# EAGLE design single_motor_driver_v6_patino (EAGLE 8.2.2)
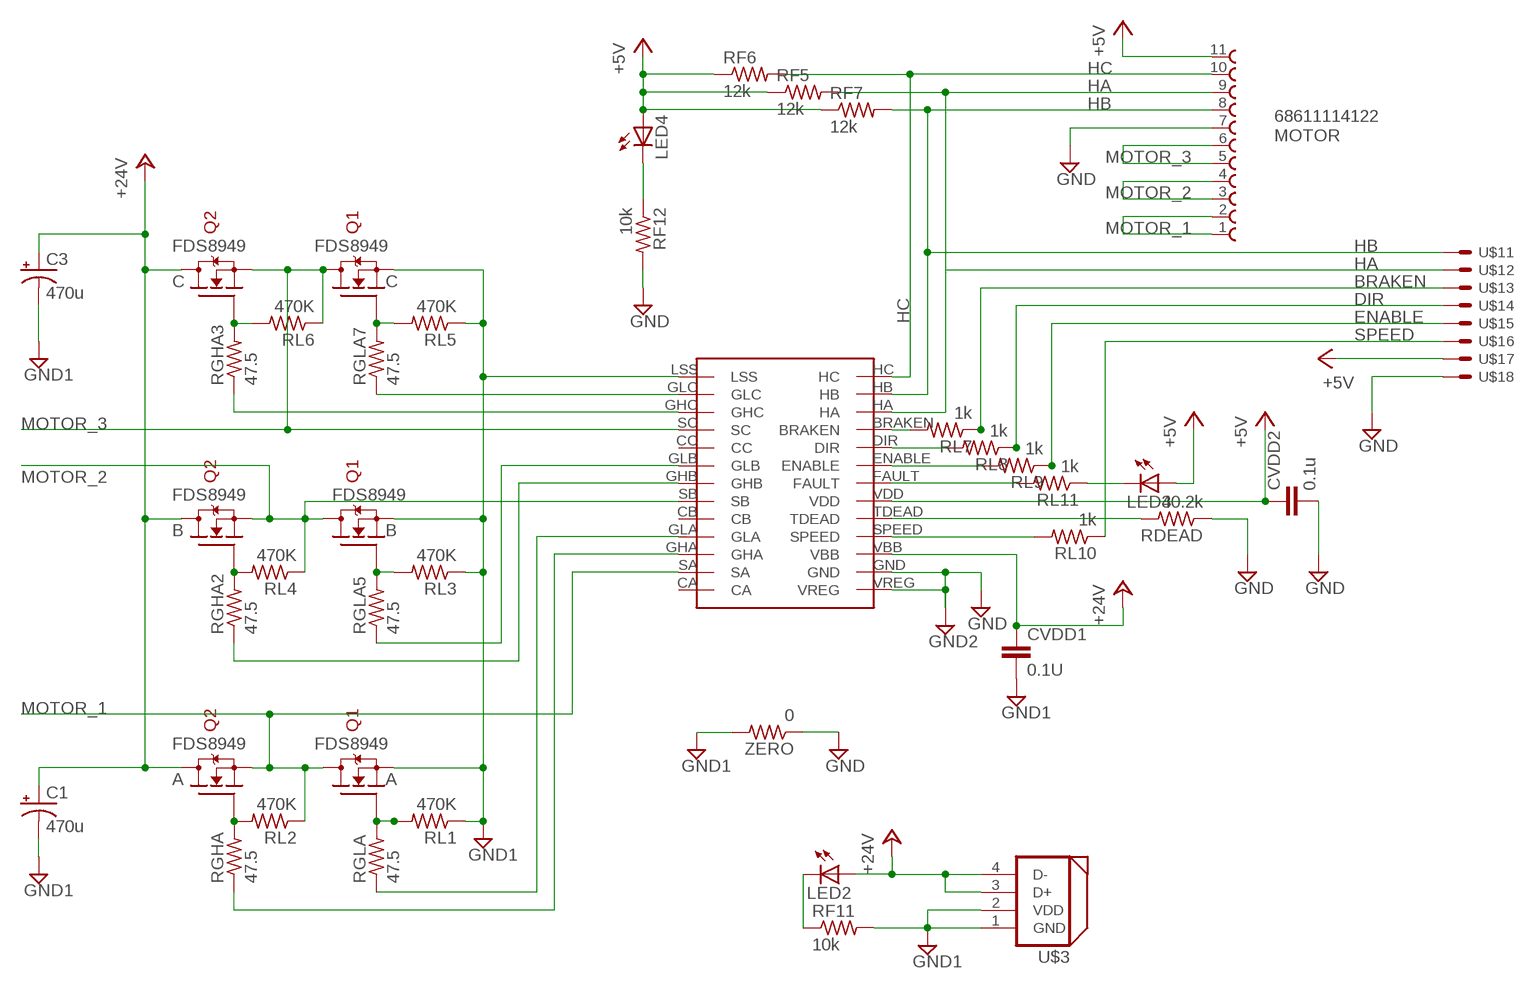
[diagram p0: schematic, sheet 1]

## Parts
A  FDS8949  [SOIC8]
B  FDS8949  [SOIC8]
C  FDS8949  [SOIC8]
C1  470u  CPOL-US140CLH-1010  [140CLH-1010]
C3  470u  CPOL-US140CLH-1010  [140CLH-1010]
CVDD1  0.1U  C-EUC0805  [C0805]
CVDD2  0.1u  C-EUC0805  [C0805]
LED2  LEDCHIPLED_0805  [CHIPLED_0805]
LED3  LEDCHIPLED_0805  [CHIPLED_0805]
LED4  LEDCHIPLED_0805  [CHIPLED_0805]
MOTOR  68611114122  [68611114122]
RDEAD  40.2k  R-US_R0805  [R0805]
RF5  12k  R-US_R0805  [R0805]
RF6  12k  R-US_R0805  [R0805]
RF7  12k  R-US_R0805  [R0805]
RF11  10k  R-US_R0805  [R0805]
RF12  10k  R-US_R0805  [R0805]
RGHA  47.5  R-US_R0805  [R0805]
RGHA2  47.5  R-US_R0805  [R0805]
RGHA3  47.5  R-US_R0805  [R0805]
RGLA  47.5  R-US_R0805  [R0805]
RGLA5  47.5  R-US_R0805  [R0805]
RGLA7  47.5  R-US_R0805  [R0805]
RL1  470K  R-US_R0805  [R0805]
RL2  470K  R-US_R0805  [R0805]
RL3  470K  R-US_R0805  [R0805]
RL4  470K  R-US_R0805  [R0805]
RL5  470K  R-US_R0805  [R0805]
RL6  470K  R-US_R0805  [R0805]
RL7  1k  R-US_R0805  [R0805]
RL8  1k  R-US_R0805  [R0805]
RL9  1k  R-US_R0805  [R0805]
RL10  1k  R-US_R0805  [R0805]
RL11  1k  R-US_R0805  [R0805]
U$1  JST8  [JST]
U$2  TSSOP28-BRK  [TSSOP28-BRK]
U$3  DYNAMIXEL_RS485  [DYNAMIXEL_SPOX_04]
ZERO  0  R-US_R0805  [R0805]

## Nets
+5V: CVDD2.1 LED3.A LED4.A MOTOR.11 RF5.1 RF6.1 RF7.1 U$1.7 U$2.VDD
+24V: A.5(D2) A.6(D2) B.5(D2) B.6(D2) C1.+ C3.+ C.5(D2) C.6(D2) CVDD1.1 LED2.A U$2.VBB U$3.3(D+) U$3.4(D-)
BRAKEN: RL7.1 U$1.3
DIR: RL8.1 U$1.4
ENABLE: RL9.1 U$1.5
GND: CVDD2.2 MOTOR.7 RDEAD.1 RF12.2 U$1.8 U$2.GND U$2.VREG ZERO.1 ; supply symbol labelled GND2
HA: MOTOR.9 RF5.2 U$1.2 U$2.HA
HB: MOTOR.8 RF7.2 U$1.1 U$2.HB
HC: MOTOR.10 RF6.2 U$2.HC
MOTOR_1: A.3(S2) A.7(D1) A.8(D1) MOTOR.1 MOTOR.2 RL2.1 U$2.SA
MOTOR_2: B.3(S2) B.7(D1) B.8(D1) MOTOR.3 MOTOR.4 RL4.1 U$2.SB
MOTOR_3: C.3(S2) C.7(D1) C.8(D1) MOTOR.5 MOTOR.6 RL6.1 U$2.SC
N$7: B.2(G1) RGLA5.2 RL3.2
N$8: B.4(G2) RGHA2.2 RL4.2
N$15: C.2(G1) RGLA7.2 RL5.2
N$17: RGHA.1 U$2.GHA
N$18: C.4(G2) RGHA3.2 RL6.2
N$20: RGLA.1 U$2.GLA
N$24: RGLA7.1 U$2.GLC
N$25: RGLA5.1 U$2.GLB
N$26: RGHA2.1 U$2.GHB
N$27: RGHA3.1 U$2.GHC
N$32: A.2(G1) RGLA.2 RL1.2
N$33: A.4(G2) RGHA.2 RL2.2
N$40: RL10.2 U$2.SPEED
N$41: RL9.2 U$2.ENABLE
N$42: RL8.2 U$2.DIR
N$44: RL7.2 U$2.BRAKEN
N$45: RDEAD.2 U$2.TDEAD
N$46: RL11.2 U$2.FAULT
N$47: LED3.C RL11.1
N$48: LED2.C RF11.1
N$59: LED4.C RF12.1
PGND: A.1(S1) B.1(S1) C1.- C3.- C.1(S1) CVDD1.2 RF11.2 RL1.1 RL3.1 RL5.1 U$2.LSS U$3.1(GND) U$3.2(VDD) ZERO.2 ; supply symbol labelled GND1
SPEED: RL10.1 U$1.6
Unconnected: U$2.CA U$2.CB U$2.CC

## Library data of the parts
A B C = dedo:FDS8949: Dual N-Channel PowerTrench® MOSFET https://www.fairchildsemi.com/datasheets/FD/FDS8949.pdf
C1 C3 = resistor:CPOL-US: POLARIZED CAPACITOR, American symbol
CVDD1 CVDD2 = resistor:C-EU: CAPACITOR, European symbol
LED2-LED4 = adafruit:LED: LED OSRAM: - CHIPLED LG R971, LG N971, LY N971, LG Q971, LY Q971, LO R971, LY R971 LH N974, LH R974 LS Q976, LO Q976, LY Q976 LO Q996 - Hyper CHIPLED LW Q18S LB Q993, LB Q99A, LB R99A - SideLED LS A670, LO A670, LY A670, LG A670, LP A670 LB A673, LV A673, LT A673, LW A673 LH A674 LY A675 LS A676, LA A676, LO A676, LY A676, LW A676 LS A679, LY A679, LG A679 - Hyper Micro SIDELED® LS Y876, LA Y876, LO Y876, LY Y876 LT Y87S - SmartLED LW L88C, LW L88S LB L89C, LB L89S, LG L890 LS L89K, LO L89K, LY L89K LS L896, LA L896, LO L896, LY L896 - TOPLED LS T670, LO T670, LY T670, LG T670, LP T670 LSG T670, LSP T670, LSY T670, LOP T670, LYG T670 LG T671, LOG T671, LSG T671 LB T673, LV T673, LT T673, LW T673 LH T674 LS T676, LA T676, LO T676, LY T676, LB T676, LH T676, LSB T676, LW T676 LB T67C, LV T67C, LT T67C, LS T67K, LO T67K, LY T67K, LW E67C LS E67B, LA E67B, LO E67B, LY E67B, LB E67C, LV E67C, LT E67C LW T67C LS T679, LY T679, LG T679 LS T770, LO T770, LY T770, LG T770, LP T770 LB T773, LV T773, LT T773, LW T773 LH T774 LS E675, LA E675, LY E675, LS T675 LS T776, LA T776, LO T776, LY T776, LB T776 LHGB T686 LT T68C, LB T68C - Hyper Mini TOPLED® LB M676 - Mini TOPLED Santana® LG M470 LS M47K, LO M47K, LY M47K Source: http://www.osram.convergy.de/
MOTOR = FPC_Connectors_Flat_Flexible_Cable_rev15c:68611114122: WR-FPC 1.00mm SMT ZIF Horizontal Top Contact, 11 Pins=>Code : Con_FPC_ZIF_1.00_68611114122 <http://katalog.we-online.de/media/images/eican/Con_FPC_ZIF_1.00_6861xx14122_pf2.jpg> Details see: http://katalog.we-online.de/en/em/686_1xx_141_22 Created 2014-07-09, Karrer Zheng 2014 (C) Würth Elektronik
RDEAD RF5-RF7 RF11 RF12 RGHA RGHA2 RGHA3 RGLA RGLA5 RGLA7 RL1-RL11 ZERO = resistor:R-US_: RESISTOR, American symbol
U$1 = dedo:JST8
U$2 = dedo:TSSOP28-BRK
U$3 = uchile_robotics_eagle_lib:DYNAMIXEL_RS485: Dynamixel RS-485 Connector Molex LLC SPOX 4 Male connector Digikey code: WM18888-ND

## Net classes
0 default: clearance 0.205 mm

## Board
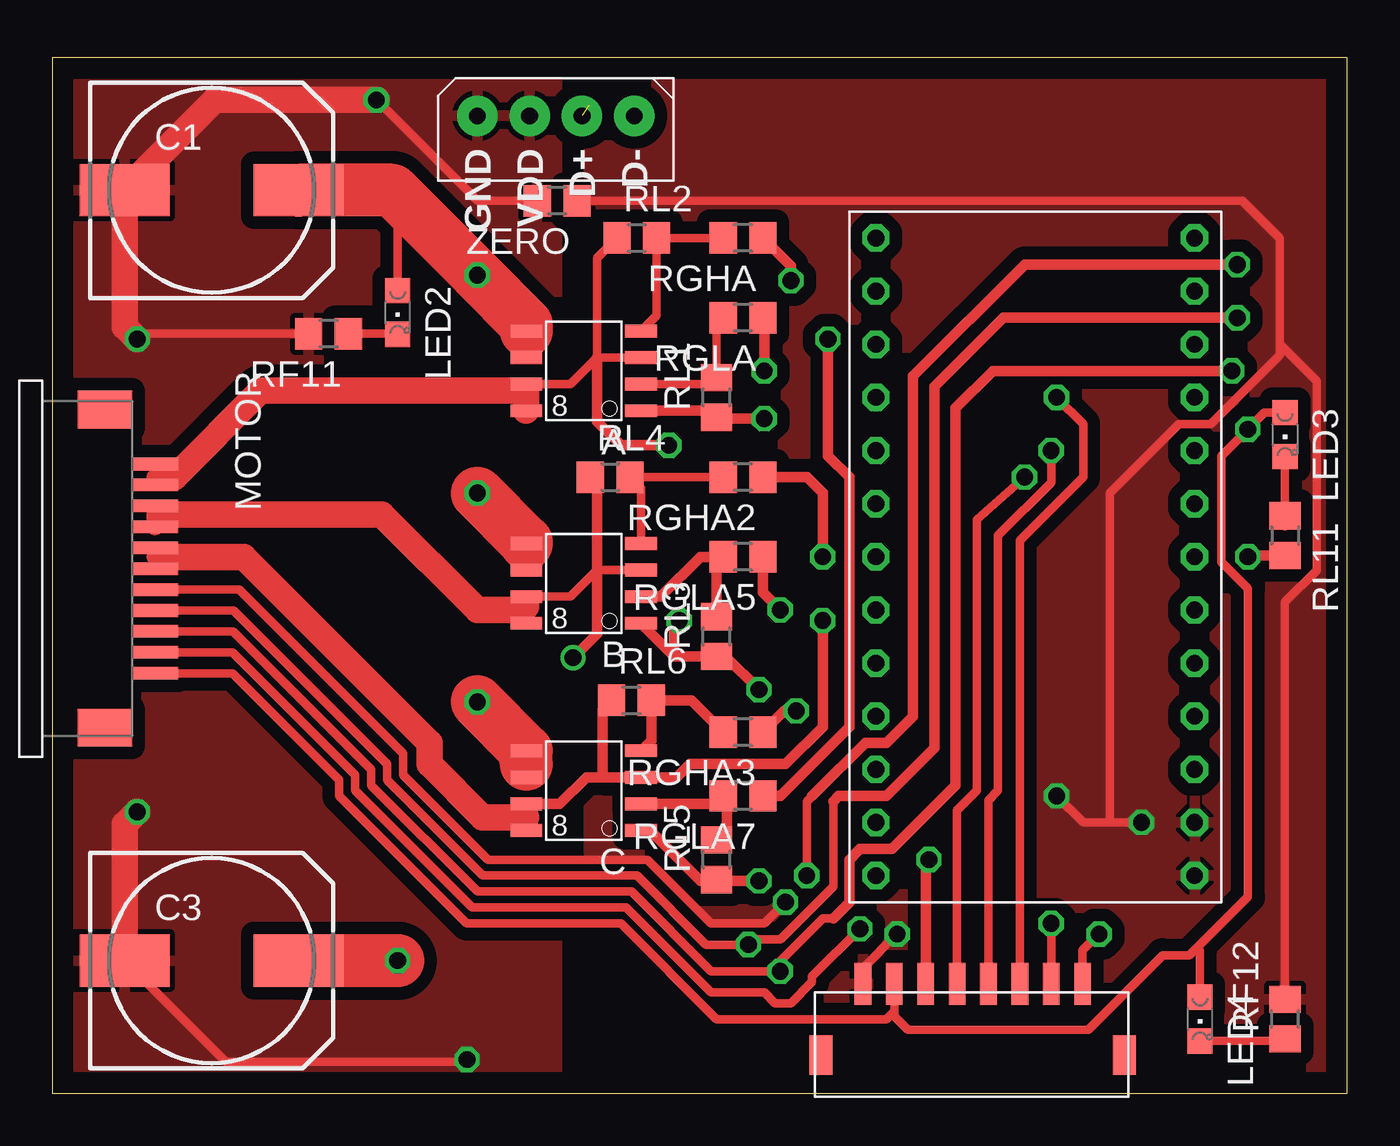
[diagram p1: board, top side]
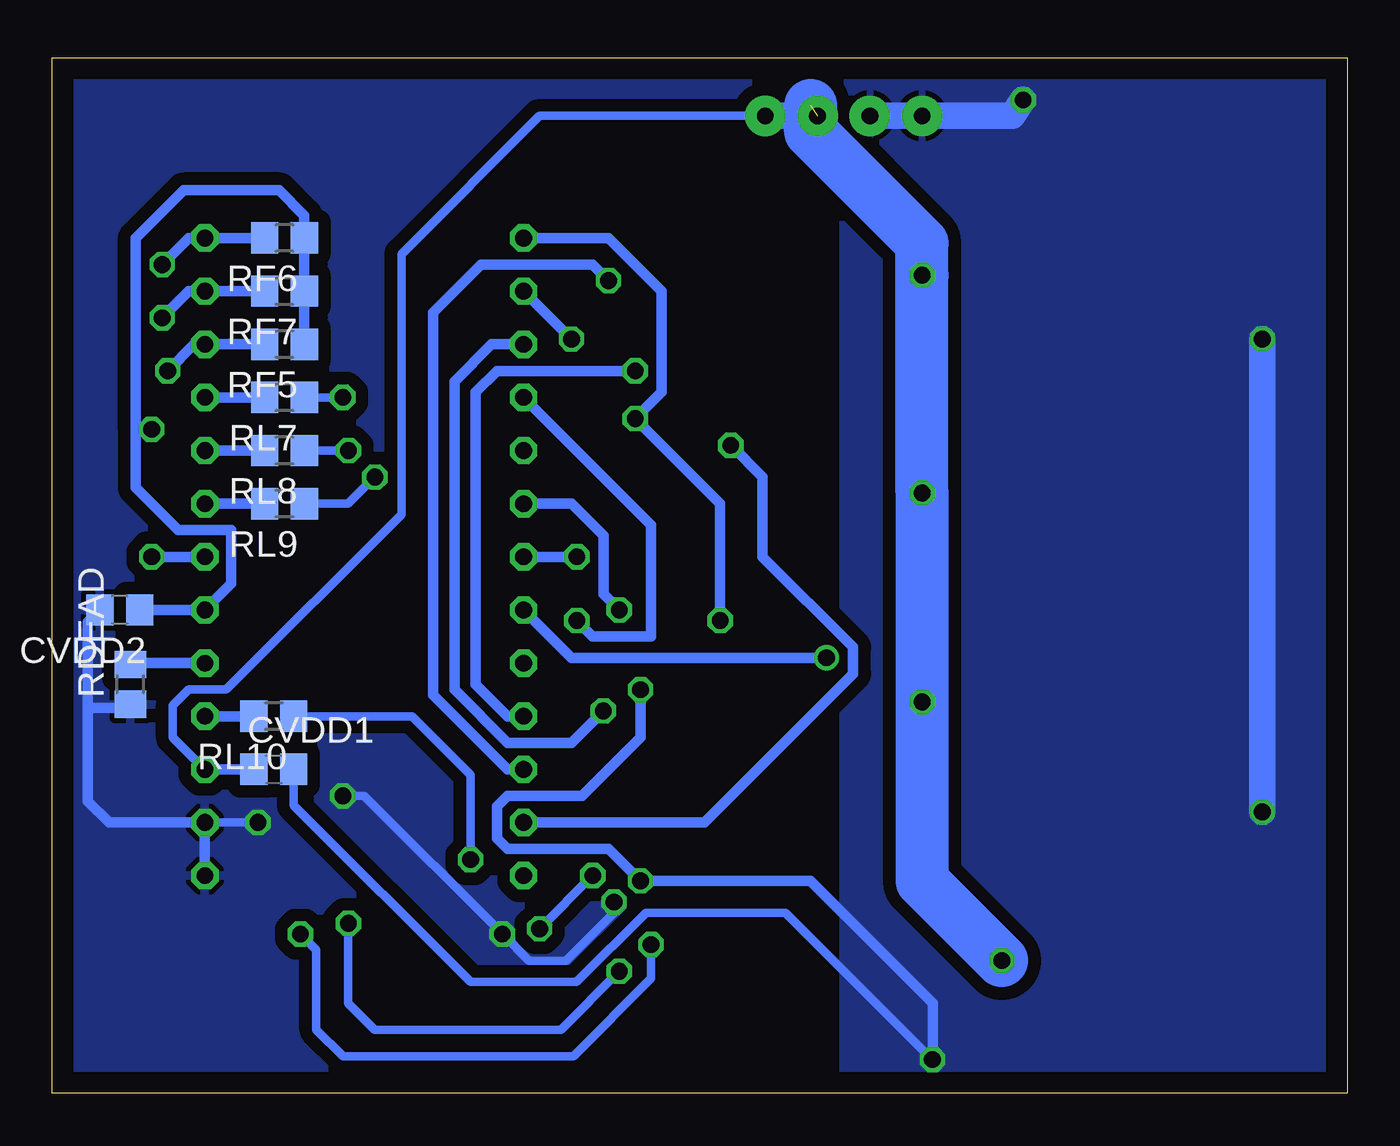
[diagram p2: board, bottom side, seen from below]

Size 61.9 x 49.52 mm. Coordinates in mm from the lower left corner, seen from the top.
Outline: 0,0 61.9,0 61.9,49.52 0,49.52 0,0
Copper layers (1*16): Top 0.035mm / dielectric 1.5mm / Bottom 0.035mm
Design rules "default": minimum track width 6mil, minimum drill 0.35mm, track to track 6mil, track to pad 6mil, pad to pad 6mil, via to via 6mil, smd to smd 6mil, copper to edge 40mil, drill to drill 6mil, minimum pad ring 10mil, minimum via ring 8mil, stop-mask expansion 4mil, vias tented up to drill 0mil, thermal gap 10mil

### Footprints (pad centres in the part's own frame; a part is rotated, then mirrored left to right if it is on the bottom)
SOIC8 = smd 1.524 x 0.61: 1 -2.743,1.905; 2 -2.743,0.635; 3 -2.743,-0.635; 4 -2.743,-1.905; 5 2.743,-1.905; 6 2.743,-0.635; 7 2.743,0.635; 8 2.743,1.905
140CLH-1010 = smd 4.3 x 2.5: + 4.15,0; - -4.15,0
C0805 = smd 1.3 x 1.5: 1 -0.95,0; 2 0.95,0
CHIPLED_0805 = smd 1.2 x 1.2: A 0,-1.05; C 0,1.05
68611114122 = smd 0.6 x 2.2: 1 -8.5,1.1; 2 -7.5,1.1; 3 -6.5,1.1; 4 -5.5,1.1; 5 -4.5,1.1; 6 -3.5,1.1; 7 -2.5,1.1; 8 -1.5,1.1; 9 -0.5,1.1; 10 0.5,1.1; 11 1.5,1.1 | smd 1.8 x 2.6: Z1 -11.1,-1.3; Z2 4.1,-1.3
R0805 = smd 1.3 x 1.5: 1 -0.95,0; 2 0.95,0
JST = smd 0.8 x 2: 1 -4.8,-2.7; 2 -3.3,-2.7; 3 -1.8,-2.7; 4 -0.3,-2.7; 5 1.2,-2.7; 6 2.7,-2.7; 7 4.2,-2.7; 8 5.7,-2.7 | smd 1.1 x 1.9: 9 -6.8,0.7; 10 7.7,0.7
TSSOP28-BRK = drill 0.8 octagon: BRAKEN 7.62,8.89; CA -7.62,-13.97; CB -7.62,-3.81; CC -7.62,6.35; DIR 7.62,6.35; ENABLE 7.62,3.81; FAULT 7.62,1.27; GHA -7.62,-8.89; GHB -7.62,1.27; GHC -7.62,11.43; GLA -7.62,-6.35; GLB -7.62,3.81; GLC -7.62,13.97; GND 7.62,-11.43; HA 7.62,11.43; HB 7.62,13.97; HC 7.62,16.51; LSS -7.62,16.51; SA -7.62,-11.43; SB -7.62,-1.27; SC -7.62,8.89; SPEED 7.62,-6.35; TDEAD 7.62,-3.81; VBB 7.62,-8.89; VDD 7.62,-1.27; VREG 7.62,-13.97
DYNAMIXEL_SPOX_04 = drill 0.8 pad 1.93: 1 0,0; 2 2.5,0; 3 5,0; 4 7.5,0

### Placement (x,y rotation side)
A  25.4,34.54 180 top
B  25.4,24.38 180 top
C  25.4,14.48 180 top
C1  7.62,43.18 0 top
C3  7.62,6.35 0 top
CVDD1  51.31,15.49 0 bottom
CVDD2  58.67,23.11 180 bottom
LED2  16.51,37.34 180 top
LED3  58.93,31.5 180 top
LED4  54.86,3.56 180 top
MOTOR  3.81,21.59 270 top
RDEAD  58.17,19.56 90 bottom
RF5  50.8,35.81 180 bottom
RF6  50.8,40.89 180 bottom
RF7  50.8,38.35 180 bottom
RF11  13.21,36.32 180 top
RF12  58.93,3.56 90 top
RGHA  33.02,40.89 180 top
RGHA2  33.02,29.46 180 top
RGHA3  33.02,17.27 180 top
RGLA  33.02,37.08 180 top
RGLA5  33.02,25.65 180 top
RGLA7  33.02,14.22 180 top
RL1  31.75,33.27 90 top
RL2  27.94,40.89 0 top
RL3  31.75,21.84 90 top
RL4  26.67,29.46 0 top
RL5  31.75,11.18 90 top
RL6  27.69,18.8 0 top
RL7  50.8,33.27 180 bottom
RL8  50.8,30.73 180 bottom
RL9  50.8,28.19 180 bottom
RL10  51.31,18.03 180 bottom
RL11  58.93,26.67 270 top
U$1  44.45,2.54 180 top
U$2  46.99,24.38 0 top
U$3  20.32,46.74 0 top
ZERO  24.13,42.67 180 top

### Tracks (layer width: path | path; a pad name or v marks a point on that pad's centre or on a via)
+5V  (via drill 0.8)
  Top 0.406: MOTOR.11 8.61,20.09 13.72,14.99 13.72,14.22 19.81,8.13 27.18,8.13 31.75,3.56 39.88,3.56 40.25,3.93 U$1.7 40.25,3.69 40.89,3.05 49.53,3.05 53.09,6.6 54.36,6.6 54.73,6.98 | 54.73,6.98 57.15,9.4 57.15,24.13 55.88,25.4 55.88,30.48 v57.15,31.75 57.95,32.55 LED3.A | LED4.A 54.86,6.85 54.73,6.98
  Bottom 0.406: v57.15,31.75 57.89,31.75 57.91,31.73
  Bottom 0.508: RF5.1 RF6.1 | RF7.1 RF6.1 | CVDD2.1 U$2.VDD 53.34,24.38 53.34,26.92 55.88,26.92 57.91,28.96 57.91,31.73 57.91,40.89 55.63,43.18 51.05,43.18 49.85,41.98 RF6.1
+24V  (via drill 0.8)  (1 unrouted)
  Top 0.406: LED2.A 16.51,42.93 16.26,43.18
  Top 0.508: C.6 22.66,15.75 C.5 | B.6 B.5 | A.5 A.6
  Top 2.54: A.5 22.66,36.78 v20.32,39.12 16.26,43.18 C1.+ | v16.51,6.35 C3.+ | 22.66,15.75 C.5 v20.32,18.72 | B.5 22.66,26.36 v20.32,28.7
  Bottom 0.406: U$2.VBB 56.13,17.02 56.13,18.54 55.37,19.3 53.59,19.3 45.21,27.69 45.21,40.13 38.61,46.74 U$3.4
  Bottom 0.508: U$2.VBB CVDD1.1
  Bottom 1.27: U$3.4 U$3.3
  Bottom 2.54: v16.51,6.35 20.32,10.16 v20.32,18.72 v20.32,28.7 v20.32,39.12 20.32,40.64 25.65,45.97 25.65,47.23
BRAKEN  (via drill 0.8)
  Top 0.406: U$1.3 46.25,26.44 49.28,29.46 49.28,32 v48.01,33.27
  Bottom 0.406: v48.01,33.27 RL7.1
DIR  (via drill 0.8)
  Top 0.406: U$1.4 44.75,14.02 45.21,14.48 45.21,26.67 47.75,29.21 v47.75,30.73
  Bottom 0.406: v47.75,30.73 RL8.1
ENABLE  (via drill 0.8)
  Top 0.406: U$1.5 43.25,13.53 44.2,14.48 44.2,27.43 v46.48,29.46
  Bottom 0.406: v46.48,29.46 47.75,28.19 RL9.1
GND  (via drill 0.8)
  Top 0.406: MOTOR.7 8.93,24.09 16.76,16.26 16.76,15.24 20.83,11.18 28.45,11.18 31.5,8.13 34.04,8.13 v35.05,9.14 | v40.39,7.62 38.75,5.98 U$1.8 | v48.01,14.22 49.28,12.95 50.47,12.95 | 50.47,12.95 v52.07,12.95 | ZERO.1 56.9,42.67 58.67,40.89 58.67,35.82 | 58.67,35.82 58.67,35.31 55.37,32 53.85,32 50.55,28.7 50.55,13.03 50.47,12.95 | RF12.2 58.93,23.49 60.44,25 60.44,34.05 58.67,35.82
  Bottom 0.406: v35.05,9.14 35.05,8.64 37.34,6.35 39.12,6.35 v40.39,7.62 46.99,14.22 v48.01,14.22 | v52.07,12.95 54.85,12.95
  Bottom 0.508: CVDD2.2 60.2,22.54 60.2,18.43 | 60.2,18.43 60.2,13.97 59.18,12.95 54.85,12.95 | RDEAD.1 58.34,18.43 60.2,18.43 | U$2.GND U$2.VREG
  pour Top (isolate 0.61): 25.65,0 61.98,0 61.98,49.53 25.65,49.53
  pour Bottom (isolate 0.61): 25.65,49.53 61.98,49.53 61.98,0 25.65,0
HA  (via drill 0.8)
  Top 0.406: MOTOR.9 8.64,22.09 15.24,15.49 15.24,14.73 20.32,9.65 27.69,9.65 31.5,5.84 v34.8,5.84 34.8,6.35 36.83,8.38 37.34,8.38 | v47.75,8.13 U$1.2
  Top 0.508: v56.39,34.54 44.96,34.54 43.18,32.77 43.18,14.73 40.13,11.68 38.61,11.68 38.1,11.18 38.1,9.14 37.34,8.38
  Bottom 0.406: v34.8,5.84 37.59,3.05 46.48,3.05 47.75,4.32 v47.75,8.13
  Bottom 0.508: RF5.2 U$2.HA 55.12,35.81 v56.39,34.54
HB  (via drill 0.8)
  Top 0.406: MOTOR.8 8.66,23.09 16,15.75 16,14.99 20.57,10.41 27.94,10.41 31.24,7.11 v33.27,7.11 33.53,7.37 34.8,7.37 37.34,9.91 37.34,13.97 | v50.04,7.62 49.25,6.83 U$1.1
  Top 0.508: v56.64,37.08 45.47,37.08 42.16,33.78 42.16,16.51 39.88,14.22 37.59,14.22 37.34,13.97
  Bottom 0.406: v33.27,7.11 33.27,5.49 36.99,1.78 48.01,1.78 49.28,3.05 49.28,6.86 v50.04,7.62
  Bottom 0.508: RF7.2 U$2.HB 55.37,38.35 v56.64,37.08
HC  (via drill 0.8)
  Top 0.406: MOTOR.10 8.63,21.09 14.48,15.24 14.48,14.48 20.07,8.89 27.43,8.89 31.5,4.83 34.04,4.83 34.54,4.32 35.31,4.32 36.32,5.33 36.32,5.59 v38.61,7.87 | v36.07,10.41 36.07,13.97 36.5,14.4
  Top 0.508: v56.64,39.62 46.48,39.62 41.15,34.29 41.15,18.03 39.88,16.76 38.86,16.76 36.5,14.4 36.32,14.22
  Bottom 0.406: v38.61,7.87 v36.07,10.41
  Bottom 0.508: RF6.2 U$2.HC 55.37,40.89 v56.64,39.62
MOTOR_1  (via drill 0.8)
  Top 0.406: A.7 24.77,33.91 26.04,35.18 | 26.04,35.18 A.3 | 26.04,35.18 26.04,39.94 RL2.1
  Top 0.508: v29.46,30.99 27.18,30.99 26.04,32.13 26.04,35.18 | MOTOR.2 4.91,29.46 MOTOR.1 | 22.66,33.59 A.7
  Top 0.813: 4.91,29.46 5.84,29.46
  Top 1.27: 5.84,29.46 9.97,33.59 22.66,33.59 A.8
  Bottom 0.508: U$2.SA 30.73,12.95 23.62,20.07 23.62,21.34 27.94,25.65 27.94,29.46 v29.46,30.99
MOTOR_2  (via drill 0.8)
  Top 0.406: B.7 24.77,23.75 26.04,25.02 B.3
  Top 0.508: RL4.1 26.04,29.15 26.04,25.02 26.04,21.97 v24.89,20.83 | B.8 22.66,23.28 B.7 | MOTOR.3 4.91,27.63
  Top 0.813: MOTOR.4 4.91,27.63 4.91,27.69 6.1,27.69
  Top 1.27: 6.1,27.69 15.75,27.69 20.32,23.11 22.49,23.11 22.66,23.28
  Bottom 0.508: U$2.SB 37.08,20.83 v24.89,20.83
MOTOR_3  (via drill 0.8)
  Top 0.508: 26.31,15.11 25.53,15.11 24.26,13.84 C.7 22.66,13.19 C.8 | 26.31,15.11 C.3 29.84,15.11 30.48,15.75 35.05,15.75 36.83,17.53 v36.83,22.61 | RL6.1 26.31,18.37 26.31,15.11 | MOTOR.5 4.91,25.65 MOTOR.6
  Top 0.813: 4.91,25.65 5.84,25.65
  Top 1.27: 5.84,25.65 9.14,25.65 18.03,16.76 18.03,15.75 20.57,13.21 22.64,13.21 22.66,13.19
  Bottom 0.508: U$2.SC 33.27,27.18 33.27,21.84 36.07,21.84 v36.83,22.61
N$7
  Top 0.508: B.2 29.08,23.75 30.99,25.65 RGLA5.2 31.75,25.33 RL3.2
N$8
  Top 0.406: RGHA2.2 RL4.2 28.14,28.94 B.4
N$15
  Top 0.508: C.2 32.13,13.84 arc-90 32.26,13.72 | 32.26,13.72 32.26,14.04 arc90 RGLA7.2 | RL5.2 32.26,12.13 32.26,13.72
N$17  (via drill 0.8)
  Top 0.508: v35.31,38.86 35.31,39.56 RGHA.1
  Bottom 0.508: U$2.GHA 40.13,15.49 43.69,19.05 43.69,37.34 41.4,39.62 36.07,39.62 v35.31,38.86
N$18
  Top 0.508: C.4 28.64,16.88 RL6.2 30.55,18.8 RGHA3.2
N$20  (via drill 0.8)
  Top 0.508: v34.04,34.54 34.04,37.02 RGLA.1
  Bottom 0.508: U$2.GLA 40.13,18.03 41.66,19.56 41.66,33.53 40.64,34.54 v34.04,34.54
N$24  (via drill 0.8)
  Top 0.508: v37.08,36.07 37.08,30.48 38.1,29.46 38.1,17.53 34.8,14.22 RGLA7.1
  Bottom 0.508: U$2.GLC v37.08,36.07
N$25  (via drill 0.8)
  Top 0.508: v34.8,23.11 33.97,23.94 RGLA5.1
  Bottom 0.508: U$2.GLB 37.08,28.19 35.56,26.67 35.56,23.88 v34.8,23.11
N$26  (via drill 0.8)
  Top 0.508: v36.83,25.65 36.83,28.7 36.07,29.46 RGHA2.1
  Bottom 0.508: U$2.GHB v36.83,25.65
N$27  (via drill 0.8)
  Top 0.508: v35.56,18.29 34.99,18.29 RGHA3.1
  Bottom 0.508: U$2.GHC 40.89,35.81 42.67,34.04 42.67,19.3 40.13,16.76 37.08,16.76 v35.56,18.29
N$32
  Top 0.406: RGLA.2 31.75,36.76 RL1.2 arc-90 31.43,33.91 A.2
N$33
  Top 0.406: A.4 28.89,37.2 RL2.2 RGHA.2
N$40
  Bottom 0.508: RL10.2 U$2.SPEED
N$41
  Bottom 0.508: RL9.2 U$2.ENABLE
N$42
  Bottom 0.508: RL8.2 U$2.DIR
N$44
  Bottom 0.508: RL7.2 U$2.BRAKEN
N$45
  Bottom 0.508: RDEAD.2 58.1,20.57 U$2.TDEAD
N$46  (via drill 0.8)
  Top 0.508: v57.15,25.65 57.22,25.72 RL11.2
  Bottom 0.508: U$2.FAULT v57.15,25.65
N$47
  Top 0.406: 58.93,27.11 RL11.1 LED3.C
N$48
  Top 0.406: RF11.1 16.48,36.32 LED2.C
N$59
  Top 0.406: LED4.C 58.83,2.51 RF12.1
PGND  (via drill 0.8)
  Top 0.406: C3.- 8.3,1.52 19.94,1.52 19.84,1.62 v19.83,1.62 | v15.49,47.5 20.32,42.67 ZERO.2 | RF11.2 4.32,36.32 v4.06,36.07
  Top 0.508: A.1 31.43,32.64 arc-90 RL1.1 31.82,32.26 v34.04,32.26 | C.1 28.57,12.57 30.99,10.16 31.68,10.16 RL5.1 31.82,10.16 v33.78,10.16 | B.1 29.73,20.89 | 29.73,20.89 RL3.1 32.19,20.89 v33.78,19.3 | 29.73,20.89 29.73,22.61 v29.97,22.61
  Top 1.27: v4.06,36.07 3.47,36.66 C1.- 7.79,47.5 v15.49,47.5 | C3.- 3.47,12.87 v4.06,13.46
  Bottom 0.406: CVDD1.2 50.36,13.78 41.91,5.33 36.83,5.33 33.53,8.64 26.84,8.64 v19.83,1.62
  Bottom 0.508: U$2.LSS 35.31,40.89 32.77,38.35 32.77,33.53 v34.04,32.26 29.97,28.19 v29.97,22.61 | v33.78,19.3 33.78,17.02 36.58,14.22 40.13,14.22 40.64,13.72 40.64,12.19 40.13,11.68 35.31,11.68 v33.78,10.16 25.65,10.16 19.81,4.32 19.81,1.63 v19.83,1.62
  Bottom 1.27: v4.06,13.46 v4.06,36.07 | U$3.2 U$3.1 16,46.74 v15.49,47.5
  pour Top (isolate 0.61): 0,49.53 0,0 24.13,0 24.13,49.53
  pour Bottom (isolate 0.61): 0,49.53 0,0 24.13,0 24.13,49.53
SPEED  (via drill 0.8)
  Top 0.508: U$1.6 41.75,10.67 v41.91,11.18
  Bottom 0.406: v41.91,11.18 41.91,15.24 44.7,18.03 RL10.1